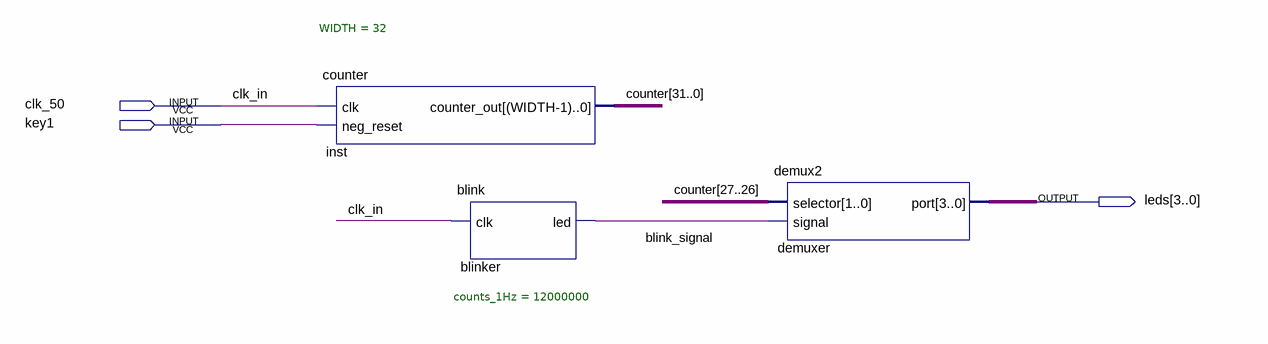
[diagram p0: schematic sheet]
// Quartus schematic demo.bdf as structural Verilog: 3 symbols, 3 pins
module demo (
  input  clk_50,
  input  key1,
  output [3:0] leds
);

  wire blink_signal;
  wire [31:0] counter;

  counter #(.WIDTH(32)) inst (.clk(clk_50), .neg_reset(key1), .counter_out(counter));
  blink #(.counts_1Hz(12000000)) blinker (.clk(clk_50), .led(blink_signal));
  demux2 demuxer (.selector(counter[27:26]), .signal(blink_signal), .port(leds));

  // Other names for the same wires on the sheet: clk_in = clk_50
endmodule
